# EAGLE design OSO-SCAP-B1-01 (EAGLE 9.4.2)
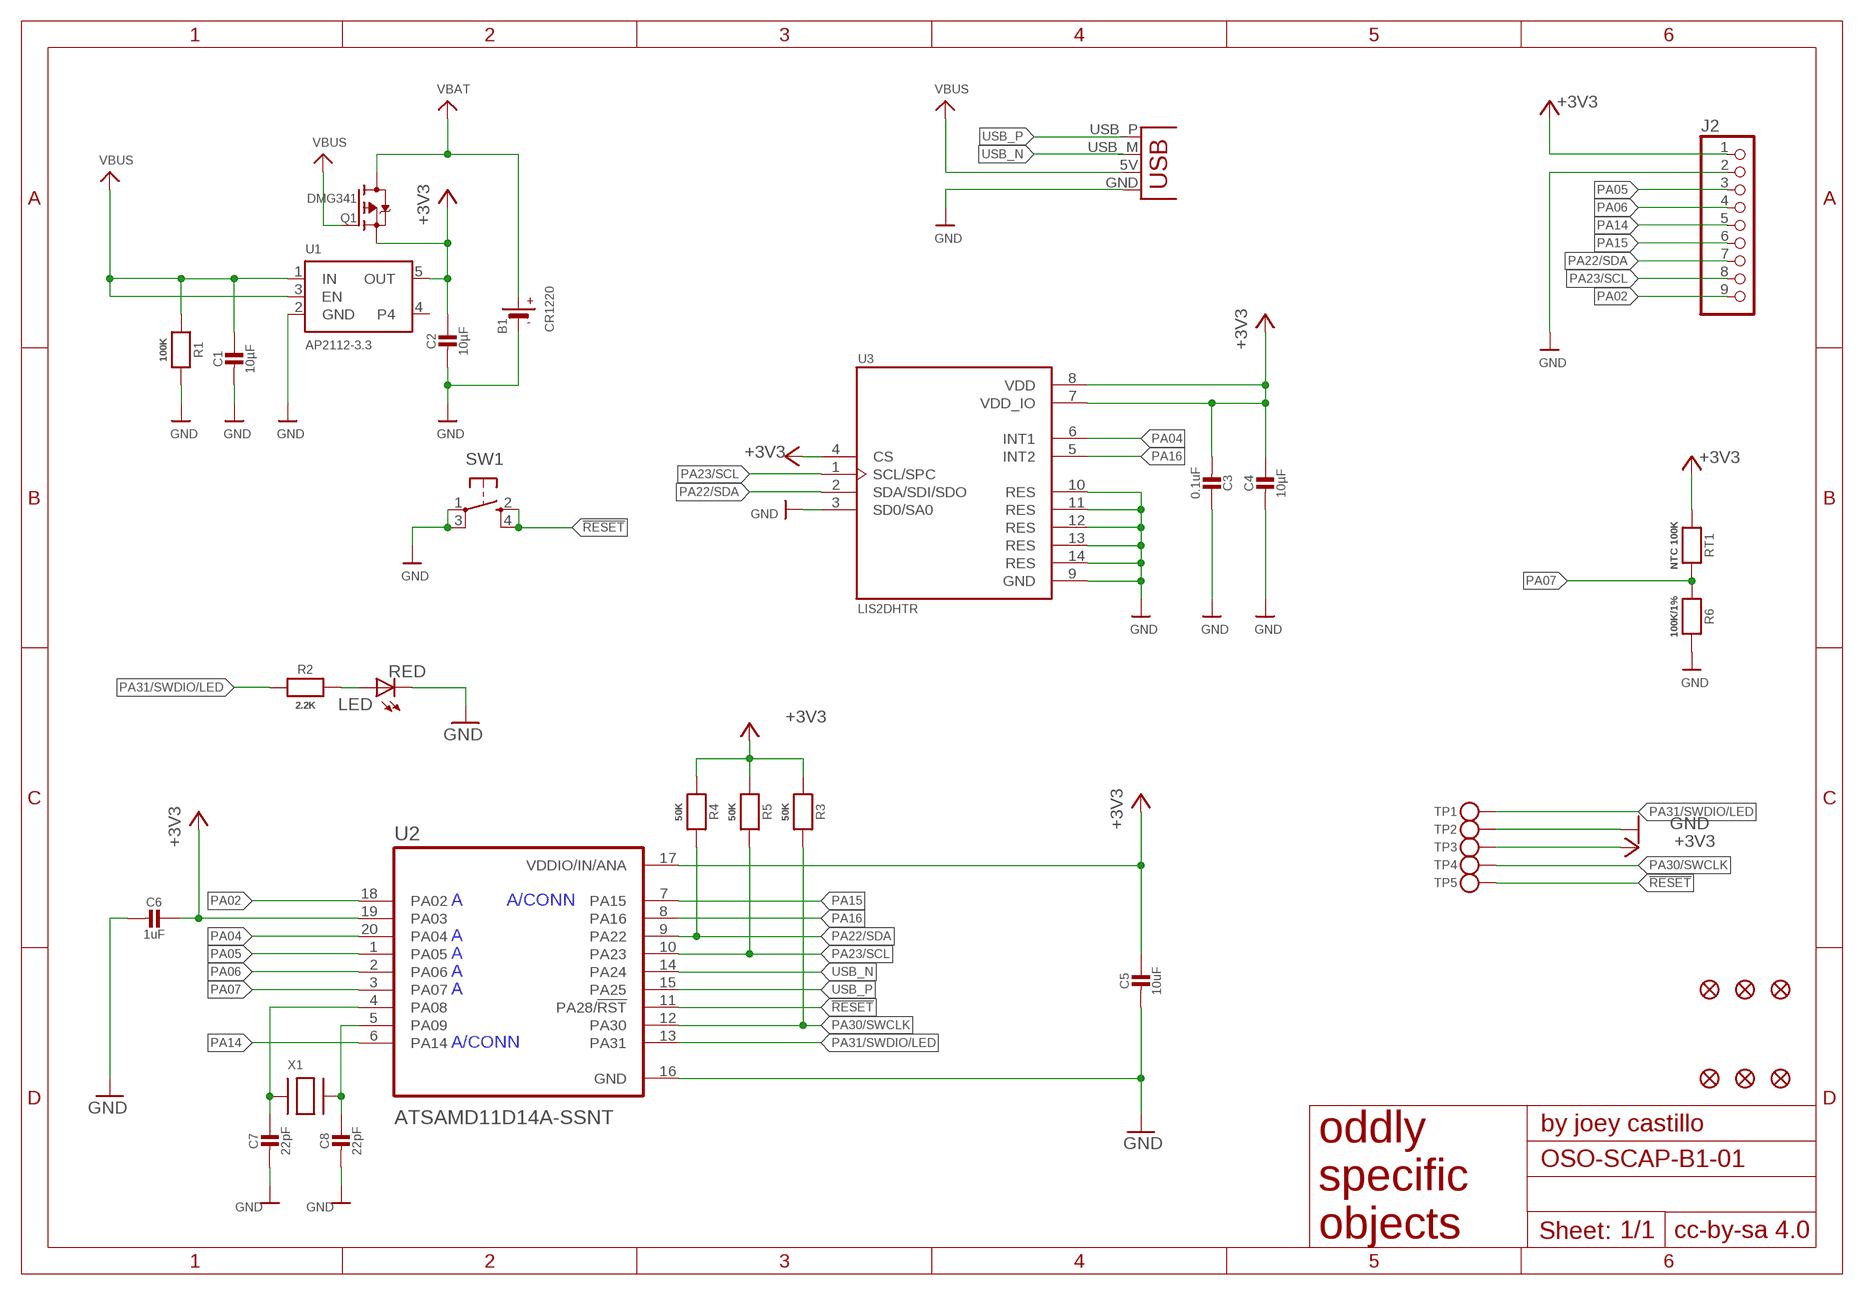
[diagram p0: schematic, sheet 1]

## Parts
B1  CR1220  BATTERYCR1220_SMT  [CR1220]
C1  10µF  CAP_CERAMIC0805-NOOUTLINE  [0805-NO]
C2  10µF  CAP_CERAMIC0805-NOOUTLINE  [0805-NO]
C3  0.1uF  CAP_CERAMIC0805-NOOUTLINE  [0805-NO]
C4  10µF  CAP_CERAMIC0805-NOOUTLINE  [0805-NO]
C5  10uF  CAP_CERAMIC0805-NOOUTLINE  [0805-NO]
C6  1uF  CAP_CERAMIC0805-NOOUTLINE  [0805-NO]
C7  22pF  CAP_CERAMIC0805-NOOUTLINE  [0805-NO]
C8  22pF  CAP_CERAMIC0805-NOOUTLINE  [0805-NO]
FID1  FIDUCIAL_1MM  [FIDUCIAL_1MM]
FID2  FIDUCIAL_1MM  [FIDUCIAL_1MM]
FID3  FIDUCIAL_1MM  [FIDUCIAL_1MM]
FID4  FIDUCIAL_1MM  [FIDUCIAL_1MM]
FID5  FIDUCIAL_1MM  [FIDUCIAL_1MM]
FID6  FIDUCIAL_1MM  [FIDUCIAL_1MM]
J1  USBPCB  [USB-A-PCB]
J2  HEADER-1X9_JSTSH  [JST_SH9]
LED  RED  LEDCHIP-LED0805  [CHIP-LED0805]
Q1  DMG341  MOSFET-P  [SOT23-R]
R1  100K  RESISTOR0805_NOOUTLINE  [0805-NO]
R2  2.2K  RESISTOR0805_NOOUTLINE  [0805-NO]
R3  50K  RESISTOR0805_NOOUTLINE  [0805-NO]
R4  50K  RESISTOR0805_NOOUTLINE  [0805-NO]
R5  50K  RESISTOR0805_NOOUTLINE  [0805-NO]
R6  100K/1%  RESISTOR0805_NOOUTLINE  [0805-NO]
RT1  NTC 100K  RESISTOR0805_NOOUTLINE  [0805-NO]
SW1  SPST_TACT-KMR2  [KMR2]
TP1  TESTPOINTROUND2MMNO  [TESTPOINT_ROUND_2MM_NO]
TP2  TESTPOINTROUND2MMNO  [TESTPOINT_ROUND_2MM_NO]
TP3  TESTPOINTROUND2MMNO  [TESTPOINT_ROUND_2MM_NO]
TP4  TESTPOINTROUND2MMNO  [TESTPOINT_ROUND_2MM_NO]
TP5  TESTPOINTROUND2MMNO  [TESTPOINT_ROUND_2MM_NO]
U1  AP2112-3.3  VREG_SOT23-5  [SOT23-5]
U2  ATSAMD11D14A-SSNT  [SOIC127P1030X265-20N]
U3  LIS2DHTR  [PQFN35P200X200X100-14N]
X1  XTAL-3.2X1.5  [XTAL3215]

## Nets
!RESET: SW1.2(S) SW1.4(S1) TP5.P$1 U2.11(PA28/!RST)
+3V3: C2.1 C3.2 C4.1 C5.1 C6.1 J2.1 Q1.2(S) R3.1 R4.1 R5.1 RT1.1 TP3.P$1 U1.5(OUT) U2.17(VDDIO/IN/ANA) U2.19(PA03) U3.4(CS) U3.7(VDD_IO) U3.8(VDD)
GND [gnd]: B1.- C1.2 C2.2 C3.1 C4.2 C5.2 C6.2 C7.2 C8.2 J1.GND J2.2 LED.C R1.2 R6.2 SW1.1(P) SW1.3(P1) TP2.P$1 U1.2(GND) U2.16(GND) U3.3(SD0/SA0) U3.9(GND) U3.10(RES) U3.11(RES) U3.12(RES) U3.13(RES) U3.14(RES)
N$5: LED.A R2.2
PA02: J2.9 U2.18(PA02)
PA04: U2.20(PA04) U3.6(INT1)
PA05: J2.3 U2.1(PA05)
PA06: J2.4 U2.2(PA06)
PA07: R6.1 RT1.2 U2.3(PA07)
PA14: J2.5 U2.6(PA14)
PA15: J2.6 U2.7(PA15)
PA16: U2.8(PA16) U3.5(INT2)
PA22/SDA: J2.7 R4.2 U2.9(PA22) U3.2(SDA/SDI/SDO)
PA23/SCL: J2.8 R5.2 U2.10(PA23) U3.1(SCL/SPC)
PA30/SWCLK: R3.2 TP4.P$1 U2.12(PA30)
PA31/SWDIO/LED: R2.1 TP1.P$1 U2.13(PA31)
USB_N: J1.USB_M(D-) U2.14(PA24)
USB_P: J1.USB_P(D+) U2.15(PA25)
VBAT [power]: B1.+$1(+) B1.+$2(+) Q1.3(D)
VBUS [power]: C1.1 J1.5V(VBUS) Q1.1(G) R1.1 U1.1(IN) U1.3(EN)
XIN32: C7.1 U2.4(PA08) X1.P$1
XOUT32: C8.1 U2.5(PA09) X1.P$2
Unconnected: U1.4

## Notes on the sheet
- A | A/CONN
- A
- A
- A
- A
- A/CONN

## Library data of the parts
B1 = microbuilder:BATTERY: CR1220 SMT - Digikey: 3001K-ND CD2032 BAT-HLD-001 - Digikey: BAT-HLD-001-ND
C1-C8 = microbuilder:CAP_CERAMIC: Ceramic Capacitors For new designs, use the packages preceded by an '_' character since they are more reliable: The following footprints should be used on most boards: _0402 - Standard footprint for regular board layouts _0603 - Standard footprint for regular board layouts _0805 - Standard footprint for regular board layouts _1206 - Standard footprint for regular board layouts For extremely tight-pitch boards where space is at a premium, the following 'micro-pitch' footprints can be used (smaller pads, no silkscreen outline, etc.): _0402MP - Micro-pitch footprint for very dense/compact boards _0603MP - Micro-pitch footprint for very dense/compact boards _0805MP - Micro-pitch footprint for very dense/compact boards _1206MP - Micro-pitch footprint for very dense/compact boards
FID1-FID6 = microbuilder:FIDUCIAL: Fiducial Alignment Points Various fiducial points for machine vision alignment.; BOM: EXCLUDE
J1 = SparkFun:USB: USB Connectors USB-B-PTH is fully proven SKU : PRT-00139 USB-miniB is fully proven SKU : PRT-00587 USB-A-PCB is untested. USB-A-H is throughly reviewed, but untested. Spark Fun Electronics SKU : PRT-00437 USB-B-SMT is throughly reviewed, but untested. Needs silkscreen touching up. USB-A-S has not been used/tested USB-MB-H has not been used/tested
J2 = microbuilder:HEADER-1X9: PIN HEADER
LED = adafruit:LED: LED OSRAM: - CHIPLED LG R971, LG N971, LY N971, LG Q971, LY Q971, LO R971, LY R971 LH N974, LH R974 LS Q976, LO Q976, LY Q976 LO Q996 - Hyper CHIPLED LW Q18S LB Q993, LB Q99A, LB R99A - SideLED LS A670, LO A670, LY A670, LG A670, LP A670 LB A673, LV A673, LT A673, LW A673 LH A674 LY A675 LS A676, LA A676, LO A676, LY A676, LW A676 LS A679, LY A679, LG A679 - Hyper Micro SIDELED® LS Y876, LA Y876, LO Y876, LY Y876 LT Y87S - SmartLED LW L88C, LW L88S LB L89C, LB L89S, LG L890 LS L89K, LO L89K, LY L89K LS L896, LA L896, LO L896, LY L896 - TOPLED LS T670, LO T670, LY T670, LG T670, LP T670 LSG T670, LSP T670, LSY T670, LOP T670, LYG T670 LG T671, LOG T671, LSG T671 LB T673, LV T673, LT T673, LW T673 LH T674 LS T676, LA T676, LO T676, LY T676, LB T676, LH T676, LSB T676, LW T676 LB T67C, LV T67C, LT T67C, LS T67K, LO T67K, LY T67K, LW E67C LS E67B, LA E67B, LO E67B, LY E67B, LB E67C, LV E67C, LT E67C LW T67C LS T679, LY T679, LG T679 LS T770, LO T770, LY T770, LG T770, LP T770 LB T773, LV T773, LT T773, LW T773 LH T774 LS E675, LA E675, LY E675, LS T675 LS T776, LA T776, LO T776, LY T776, LB T776 LHGB T686 LT T68C, LB T68C - Hyper Mini TOPLED® LB M676 - Mini TOPLED Santana® LG M470 LS M47K, LO M47K, LY M47K Source: http://www.osram.convergy.de/
Q1 = microbuilder:MOSFET-P: P-Channel Mosfet LEGEND VDS: Voltage Drain-Source ID: Drain Current RDS(ON): Drain-Source On-State Resistance VGS(TH): Gate-Source Threshold Voltage CISS: Drain-Source Input Capacitance SOT-23 Name VDS ID RDS(ON) VGS(TH) CISS Order Number IRLML5103 30V 760mA 600 mOhm -- 75pF @ 25V Digikey: IRLML5103PBFCT-ND IRLML6401 12V 4.3A 50 mOhm 950mV @ 250µA 830pF @ 10V Digikey: IRLML6401PBFTR-ND NTR0202PL 20V 400mA 800 mOhm 2.3V @ 250uA 70pF @ 5V Digikey: NTR0202PLT1GOSTR-ND NTR4101PT1G 20V 1.8A 85 mOhm 1.2V @ 250uA 675pF @ 10V Digikey: NTR4101PT1GOSCT-ND DMP2004K 20V 600mA 900 mOhm 1V @ 250uA 175pF @ 16V Digikey: DMP2004KDICT-ND PMV65XP 20V 3.9A 76 mOhm 950mV @ 1mA 725pF @ 20V Digikey: 568-2358-2-ND TO-252 Name VDS ID RDS(ON) VGS(TH) CISS Order Number AOD417 30V 25A 34 mOhm 3V @ 250µA 920pF @ 15V Digikey: 785-1106-2-ND PowerPak Name VDS ID RDS(ON) VGS(TH) CISS Order Number AON7401 30V 12A 14 mOhm 3V @ 250µA 2600pF @ 15V Digikey: 785-1302-1-ND
R1-R6 RT1 = microbuilder:RESISTOR: Resistors For new designs, use the packages preceded by an '_' character since they are more reliable: The following footprints should be used on most boards: _0402 - Standard footprint for regular board layouts _0603 - Standard footprint for regular board layouts _0805 - Standard footprint for regular board layouts _1206 - Standard footprint for regular board layouts For extremely tight-pitch boards where space is at a premium, the following 'micro-pitch' footprints can be used (smaller pads, no silkscreen outline, etc.): _0402MP - Micro-pitch footprint for very dense/compact boards _0603MP - Micro-pitch footprint for very dense/compact boards _0805MP - Micro-pitch footprint for very dense/compact boards _1206MP - Micro-pitch footprint for very dense/compact boards
SW1 = adafruit:SPST_TACT: SMT 6mm switch, EVQQ2 series http://www.ladyada.net/library/eagle
TP1-TP5 = microbuilder:TESTPOINT: Test Point Various test points for characterisation and PCB testing TESTPOINT_SMT - Compact Surface Mount Test Point [Digikey: 5016KTR-ND]
U1 = microbuilder:VREG_SOT23-5: SOT23-5 Fixed Voltage Regulators Part Current Out V Out V In V Dropout θJA (°C/W) TJ (°C) Digikey Part No. ADP121 150mA 3.3V 3.4-5.5V 0.09V @ 150mA -- -- ADP121-AUJZ33R7CT-ND ADP121 150mA 3.0V 3.1-5.5V 0.09V @ 150mA -- -- ADP121-AUJZ30R7CT-ND ADP122 300mA 3.3V 3.4-5.5V 0.085V @ 300mA -- -- ADP122AUJZ-3.3-R7CT-ND ADP1712 300mA 3.3V 3.5-5.5V 0.17V @ 300mA -- -- ADP1712AUJZ-3.3-R7TR-ND AP7311 (Low Cost) 150mA 3.3V 3.5-6V 0.15V @ 150mA -- -- AP7311-33WG-7DICT-ND LD39015M18R 150mA 1.8V 1.9V-5.5V 0.08V @ 100mA -- -- 497-6977-1-ND LP2985A-33DBVR 150mA 3.3V 3.3-16V 0.28V @ 150mA 206 150 296-18479-1-ND MCP1824T-3302E/OT 300mA 3.3V 3.5V-6V 0.2V @ 300mA -- -- MCP1824T-3302E/OTCT-ND MIC5205-2.5YM5 TR 150mA 2.5V 2.7-16V 0.165V @ 150mA -- -- 576-1257-2-ND MIC5205-3.0YM5 TR 150mA 3.0V 3.2V-16V 0.165V @ 150mA -- -- 576-1258-2-ND MIC5205-3.3YM5 TR 150mA 3.3V 3.5V-16V 0.165V @ 150mA -- -- 576-1259-2-ND TPS780330220 150mA 3.3V+2.2V 3.6-5.5V 250mV Max -- -- 296-23332-1-ND TDA3663/N1,135 100mA 3.3V 3.5-45V 0.18V @ 50mA -- -- 568-5343-1-ND Max operating temp can be calculated using θJA, TJ (max junction temperature), and power in watts. Set the "Maximum Ambient Temperature" until it reaches TJ ("Max Junction Temperature"), which is the absolute limit for safe use of the regulator: Heat Sink Temperature Calculator <http://www.daycounter.com/Calculators/Heat-Sink-Temperature-Calculator.phtml> For example, With 12V source into a 3.3V LP2985 and a 30mA load, we are dissipating (12V-3.3V) * 0.03A = 0.261W. With a θJA of 206 °C/W, a TJ of 150°C, and 261mW we can safely use the chip without a heat sink up to 75°C (=147.1°C Junction Temperature).
U2 = ATSAMD11D14A-SSNT:ATSAMD11D14A-SSNT: None; AVAILABILITY: Unavailable; DESCRIPTION: Cortex-M0+, 16kb Flash, 4kb Sram, Usb - 20 Soic, 105c, Green, 1.6-3.6v, 48mhz, Usb/ Eiqj/Soic _s_; MF: Microchip; MP: ATSAMD11D14A-SSNT; PACKAGE: SOIC-20 Atmel; PRICE: None
U3 = LIS2DHTR:LIS2DHTR: MEMS digital output motion sensor: ultra low-power high performance 3-axes femto accelerometer; DESCRIPTION: Accelerometer X, Y, Z Axis ±2g, 4g, 8g, 16g 0.5Hz ~ 672Hz 14-LGA _2x2_; DIGI-KEY_PART_NUMBER: 497-13795-1-ND; DIGI-KEY_PURCHASE_URL: https://www.digikey.com/product-detail/en/stmicroelectronics/LIS2DHTR/497-13795-1-ND/4209308?utm_source=snapeda&utm_medium=aggregator&utm_campaign=symbol; MF: STMicroelectronics; MP: LIS2DHTR; PACKAGE: LGA-14 STMicroelectronics
X1 = adafruit:XTAL: Low cost SMT crystals, no capacitors included http://www.ladyada.net/library/eagle

## Net classes
0 default: width 0.152 mm, drill 0.254 mm
1 power: width 0.305 mm, drill 0.305 mm

## Board
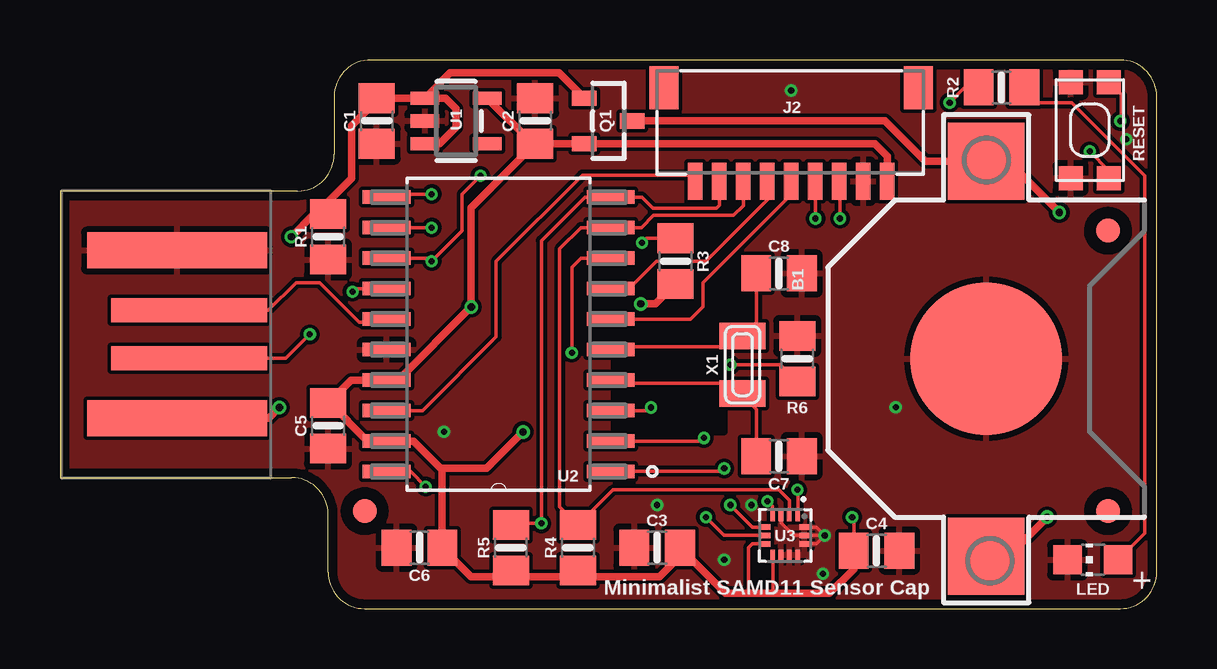
[diagram p1: board, top side]
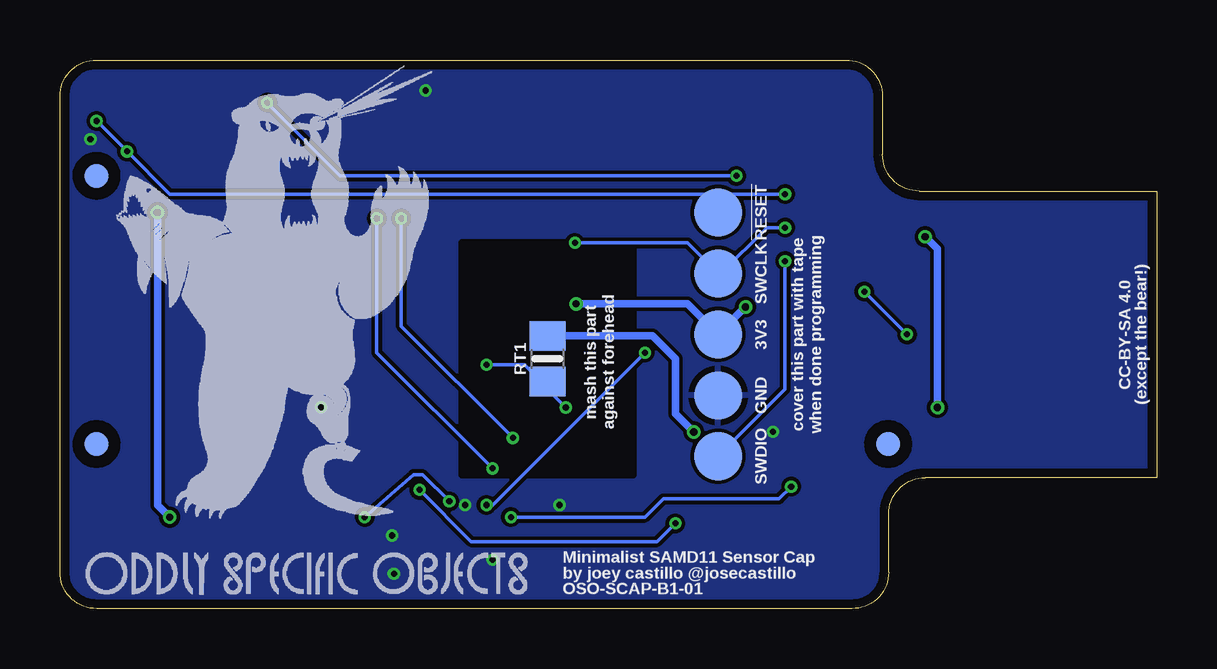
[diagram p2: board, bottom side, seen from below]

Size 45.72 x 22.86 mm. Coordinates in mm from the lower left corner, seen from the top.
Outline: 0,5.46 9.65,5.46 arc-90 11.18,3.94 11.18,1.52 arc90 12.7,0 44.2,0 arc90 45.72,1.52 45.72,21.34 arc90 44.2,22.86 12.95,22.86 arc90 11.43,21.34 11.43,18.92 arc-90 9.91,17.4 0,17.4 0,5.46
Copper layers (1*16): Top 0.035559375mm / dielectric 1.6mm / Bottom 0.035559375mm
Design rules "oshpark-2layer *": minimum track width 6mil, minimum drill 10mil, track to track 6mil, track to pad 6mil, pad to pad 6mil, via to via 6mil, smd to smd 6mil, copper to edge 15mil, drill to drill 6mil, minimum pad ring 5mil, minimum via ring 5mil, stop-mask expansion 2.5mil, vias tented up to drill 12mil, thermal gap 10mil

### Footprints (pad centres in the part's own frame; a part is rotated, then mirrored left to right if it is on the bottom)
CR1220 = smd 3.2 x 3.2: +$1 -8.225,0; +$2 8.225,0 | smd 6.35 x 6.35: - 0,0
0805-NO = smd 1.24 x 1.5: 1 -0.95,0; 2 0.95,0
FIDUCIAL_1MM = smd 1 x 1: 1 0,0
USB-A-PCB = smd 7.5 x 1.5: 5V -0.2,-3.5; GND -0.2,3.5 | smd 6.5 x 1: USB_M 0.3,-1; USB_P 0.3,1
JST_SH9 = smd 0.6 x 1.55: 1 -4,2.514; 2 -3,2.514; 3 -2,2.514; 4 -1,2.514; 5 0,2.514; 6 1,2.514; 7 2,2.514; 8 3,2.514; 9 4,2.514 | smd 1.2 x 1.8: MT1 -5.3,-1.386; MT2 5.3,-1.386
CHIP-LED0805 = smd 1.2 x 1.2: A 0,-1.05; C 0,1.05
SOT23-R = smd 0.635 x 1.016: 1 -0.95,-1; 2 0.95,-1; 3 0,1
KMR2 = smd 1 x 1: 1 2,0.8; 2 2,-0.8; 3 -2,0.8; 4 -2,-0.8
TESTPOINT_ROUND_2MM_NO = smd 2 x 2: P$1 0,0
SOT23-5 = smd 0.55 x 1.2: 1 -0.95,-1.3; 2 0,-1.3; 3 0.95,-1.3; 4 0.95,1.3; 5 -0.95,1.3
SOIC127P1030X265-20N = smd 1.981 x 0.559: 1 -4.674,5.715; 2 -4.674,4.445; 3 -4.674,3.175; 4 -4.674,1.905; 5 -4.674,0.635; 6 -4.674,-0.635; 7 -4.674,-1.905; 8 -4.674,-3.175; 9 -4.674,-4.445; 10 -4.674,-5.715; 11 4.674,-5.715; 12 4.674,-4.445; 13 4.674,-3.175; 14 4.674,-1.905; 15 4.674,-0.635; 16 4.674,0.635; 17 4.674,1.905; 18 4.674,3.175; 19 4.674,4.445; 20 4.674,5.715
PQFN35P200X200X100-14N = smd 0.39 x 0.2: 1 -0.795,0.525; 2 -0.795,0.175; 3 -0.795,-0.175; 4 -0.795,-0.525; 8 0.795,-0.525; 9 0.795,-0.175; 10 0.795,0.175; 11 0.795,0.525 | smd 0.2 x 0.39: 5 -0.35,-0.795; 6 0,-0.795; 7 0.35,-0.795; 12 0.35,0.795; 13 0,0.795; 14 -0.35,0.795
XTAL3215 = smd 1.1 x 1.9: P$1 1.2,0; P$2 -1.2,0

### Placement (x,y rotation side)
B1  38.61,10.41 270 top
C1  13.21,20.32 270 top
C2  19.81,20.32 90 top
C3  24.89,2.54 0 top
C4  34.04,2.41 0 top
C5  11.18,7.62 270 top
C6  14.99,2.54 180 top
C7  29.97,6.35 0 top
C8  29.97,13.97 0 top
FID1  12.7,4.06 0 top
FID2  43.69,4.06 0 top
FID3  43.69,15.75 0 top
FID4  11.2,6.86 0 bottom
FID5  44.2,18.03 0 bottom
FID6  44.2,6.86 0 bottom
J1  5.08,11.43 0 top
J2  30.48,20.32 180 top
LED  43.05,2.03 90 top
Q1  22.86,20.32 270 top
R1  11.18,15.49 270 top
R2  39.24,21.72 0 top
R3  25.65,14.48 90 top
R4  21.59,2.54 90 top
R5  18.8,2.54 90 top
R6  30.73,10.41 90 top
RT1  25.4,10.41 270 bottom
SW1  42.93,19.94 90 top
TP1  18.29,6.35 180 bottom
TP2  18.29,8.89 180 bottom
TP3  18.29,11.43 180 bottom
TP4  18.29,13.97 180 bottom
TP5  18.29,16.51 180 bottom
U1  16.51,20.32 270 top
U2  18.29,11.43 180 top
U3  30.23,3.05 270 top
U$16  [OSO_BEAR_525X750MIL_1000DPI]  36.83,13.21 0 bottom
U$21  [OSO_WORDMARK_ONELINE_725MIL_1000DPI]  44.7,0.51 0 bottom
X1  28.45,10.16 270 top

### Tracks (layer width: path | path; a pad name or v marks a point on that pad's centre or on a via)
!RESET  (via drill 0.25)
  Top 0.152: U2.11 13.74,17.27 v15.49,17.27 | v42.93,19.05 43.73,18.25 SW1.4 | SW1.2 44.23,21.43 44.23,20.36 v44.2,20.32
  Bottom 0.152: 18.8,17.27 v15.49,17.27 | TP5.P$1 18.03,16.51 18.8,17.27 | v44.2,20.32 v42.93,19.05 41.15,17.27 18.8,17.27
+3V3  (via drill 0.25, 0.3)
  Top 0.152: U3.8 29.72,2.24 29.72,0.64 | U3.7 28.86,2.7 28.7,2.54 28.7,0.64 | U3.4 29.7,4.26 v29.49,4.47 | C4.1 33.09,3.74 v33.02,3.81
  Top 0.305: U1.5 19.71,19.37 C2.1 | C2.1 Q1.2 33.97,19.37 34.48,18.86 J2.1 | 11.21,8.6 12.13,9.53 U2.17 14.1,9.53 v17.14,12.57 17.14,16.7 C2.1 | 11.21,8.6 C5.1 | 11.21,8.6 12.83,6.99 U2.19 14.73,6.99 15.94,5.78 | 15.94,5.78 15.94,5.84 17.78,5.84 v19.3,7.37 | 15.94,5.78 C6.1 17.14,1.34 18.54,1.34 R5.1 19.05,1.34 21.34,1.34 R4.1 21.85,1.33 24.99,1.33 25.84,2.19 C3.2 27.75,0.64 28.7,0.64 29.72,0.64 32.07,0.64 33.09,1.65 C4.1 | R3.1 24.83,12.7 v24.21,12.7
  Bottom 0.152: v29.49,4.47 30.61,5.59 30.99,5.59 v33.02,3.81
  Bottom 0.305: v17.14,12.57 TP3.P$1 19.56,12.7 v24.21,12.7 | RT1.1 21.02,11.36 20.07,10.41 20.07,8.13 v19.3,7.37
GND  (via drill 0.25)
  Top 0.152: U3.14 31.53,3.4 v31.88,3.05 | v31.88,3.05 U3.13 30.58,3.05 30.07,3.56 30.07,3.82 U3.3 | U3.12 31.53,2.7 v31.88,3.05
  other vias: 34.84,8.39 27.69,2.03 31.8,1.45 30.48,21.59 24.89,4.32 16,7.37 28.83,4.32 44.45,19.56
  pour Top: -0.25,17.02 -0.25,5.59 5.59,-0.25 44.7,-0.25 46.23,1.27 46.23,22.35 45.21,23.37 6.1,23.37
  pour Bottom: 46.48,22.35 46.48,1.52 44.7,-0.25 5.59,-0.25 -0.25,5.59 -0.25,17.02 6.1,23.37 45.47,23.37
  cutout Top: 23.11,13.46 27.69,13.46 27.69,7.37 23.11,7.37
  cutout Bottom: 28.96,15.24 21.84,15.24 21.84,5.59 28.96,5.59
N$5
  Top 0.152: LED.A 45.22,3.15 45.22,18.03 42.17,21.08 40.7,21.08 40.19,21.59 R2.2
PA02
  Top 0.152: J2.9 26.23,18.06 21.77,18.06 18.19,14.47 18.19,11.33 15.11,8.26 U2.18
PA04  (via drill 0.25)
  Top 0.152: U2.20 14.61,5.71 v15.24,5.08 | v26.92,3.81 27.69,3.05 U3.6
  Bottom 0.152: v15.24,5.08 15.75,4.57 20.57,4.57 21.34,3.81 v26.92,3.81
PA05  (via drill 0.25)
  Top 0.152: J2.3 32.51,17.77 v32.51,16.26 | v27.69,5.84 27.56,5.71 U2.1
  Bottom 0.152: v32.51,16.26 32.51,10.67 v27.69,5.84
PA06  (via drill 0.25)
  Top 0.152: J2.4 31.5,17.79 v31.5,16.26 | v26.84,7.11 26.71,6.99 U2.2
  Bottom 0.152: v31.5,16.26 31.5,11.77 v26.84,7.11
PA07  (via drill 0.25)
  Top 0.152: R6.1 30.04,10.16 v27.94,10.16 | v24.64,8.38 24.51,8.26 U2.3
  Bottom 0.152: v27.94,10.16 26.35,10.16 25.65,9.46 RT1.2 25.4,9.14 v24.64,8.38
PA14
  Top 0.152: U2.6 26.29,12.06 26.8,12.57 26.8,13.59 30.48,17.27 J2.5
PA15
  Top 0.152: U2.7 23.72,13.34 24.87,14.48 26.92,14.48 29.48,17.03 J2.6
PA16  (via drill 0.25)
  Top 0.152: U2.8 21.72,14.61 21.34,14.22 v21.34,10.67 | U3.5 28.86,3.4 v27.94,4.32
  Bottom 0.152: v27.94,4.32 27.69,4.32 v21.34,10.67
PA22/SDA
  Top 0.152: J2.7 28.48,16.8 28.07,16.38 24.74,16.38 24.23,15.88 U2.9 21.72,15.88 20.83,14.99 20.83,4.25 R4.2 23.05,4.95 29.97,4.95 30.4,4.52 U3.2
PA23/SCL  (via drill 0.25)
  Top 0.152: J2.8 27.48,16.81 27.36,16.69 24.71,16.69 24.26,17.14 U2.10 21.88,17.14 20.07,15.34 v20.07,3.56 18.8,3.56 R5.2 | v30.73,4.95 30.75,4.94 U3.1
  Bottom 0.152: v20.07,3.56 20.83,2.79 28.57,2.79 v30.73,4.95
PA30/SWCLK  (via drill 0.25)
  Top 0.152: U2.12 v15.49,15.88 | R3.2 24.45,15.43 v24.26,15.24
  Bottom 0.152: v15.49,15.88 16.26,15.88 18.16,13.97 TP4.P$1 19.56,15.24 v24.26,15.24
PA31/SWDIO/LED  (via drill 0.25)
  Top 0.152: U2.13 15.37,14.61 v15.49,14.48 16.76,15.75 16.76,17.27 v17.53,18.03 | R2.1 37.72,21.72 v37.08,21.08
  Bottom 0.152: v15.49,14.48 15.49,9.14 TP1.P$1 | v37.08,21.08 34.04,18.03 v17.53,18.03
USB_N  (via drill 0.25)
  Top 0.152: J1.USB_M 9.41,10.43 v10.41,11.43 | v12.19,13.21 12.32,13.34 U2.14
  Bottom 0.152: v10.41,11.43 v12.19,13.21
USB_P
  Top 0.152: U2.15 13.49,11.94 12.47,11.94 10.82,13.59 9.84,13.59 8.68,12.43 J1.USB_P
VBAT  (via drill 0.3)
  Top 0.305: Q1.3 34.39,20.32 36.07,18.64 B1.+$1 39.53,18.64 v41.66,16.51 | v41.15,3.81 39.53,2.19 B1.+$2
  Bottom 0.305: v41.66,16.51 41.66,4.32 v41.15,3.81
VBUS  (via drill 0.3)
  Top 0.305: J1.5V 8.69,7.93 v9.14,8.38 | v9.65,15.49 10.6,16.44 R1.1 11.18,16.95 12.15,17.93 12.15,20.12 13.21,21.17 C1.1 U1.1 | Q1.1 20.8,22.33 16.27,22.33 U1.1 | U1.1 16.07,21.27 16.51,20.83 16.51,20.07 15.81,19.37 U1.3
  Bottom 0.305: v9.65,15.49 9.14,14.99 v9.14,8.38
XIN32
  Top 0.152: U2.4 23.09,9.4 27.96,9.4 28.42,8.94 X1.P$1 28.53,8.8 29.02,8.31 C7.1
XOUT32
  Top 0.152: U2.5 23.09,10.92 28.01,10.92 X1.P$2 29.02,11.93 C8.1

### Text on the board
tPlace: RESET | Minimalist SAMD11 Sensor Cap
bPlace: !RESET | SWCLK | CC-BY-SA 4.0 / (except the bear!) | cover this part with tape / when done programming | 3V3 | mash this part / against forehead | GND | SWDIO | Minimalist SAMD11 Sensor Cap / by joey castillo @josecastillo / OSO-SCAP-B1-01